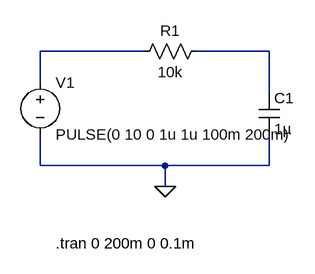
[diagram p0: schematic Circuit#1.asc]
Circuit#1.asc, the LTspice schematic file:
Version 4
SHEET 1 880 680
WIRE 208 80 48 80
WIRE 400 80 288 80
WIRE 48 128 48 80
WIRE 400 144 400 80
WIRE 48 256 48 208
WIRE 240 256 48 256
WIRE 400 256 400 208
WIRE 400 256 240 256
WIRE 240 288 240 256
FLAG 240 288 0
SYMBOL voltage 48 112 R0
WINDOW 123 0 0 Left 0
WINDOW 39 0 0 Left 0
SYMATTR InstName V1
SYMATTR Value PULSE(0 10 0 1u 1u 100m 200m)
SYMBOL res 304 64 R90
WINDOW 0 0 56 VBottom 2
WINDOW 3 32 56 VTop 2
SYMATTR InstName R1
SYMATTR Value 10k
SYMBOL cap 384 144 R0
SYMATTR InstName C1
SYMATTR Value 1µ
TEXT 72 376 Left 2 !.tran 0 200m 0 0.1m

The netlist it stands for:
* Circuit#1.asc
V1 N001 0 PULSE(0 10 0 1u 1u 100m 200m)
R1 N002 N001 10k
C1 N002 0 1µ
.tran 0 200m 0 0.1m
.backanno
.end